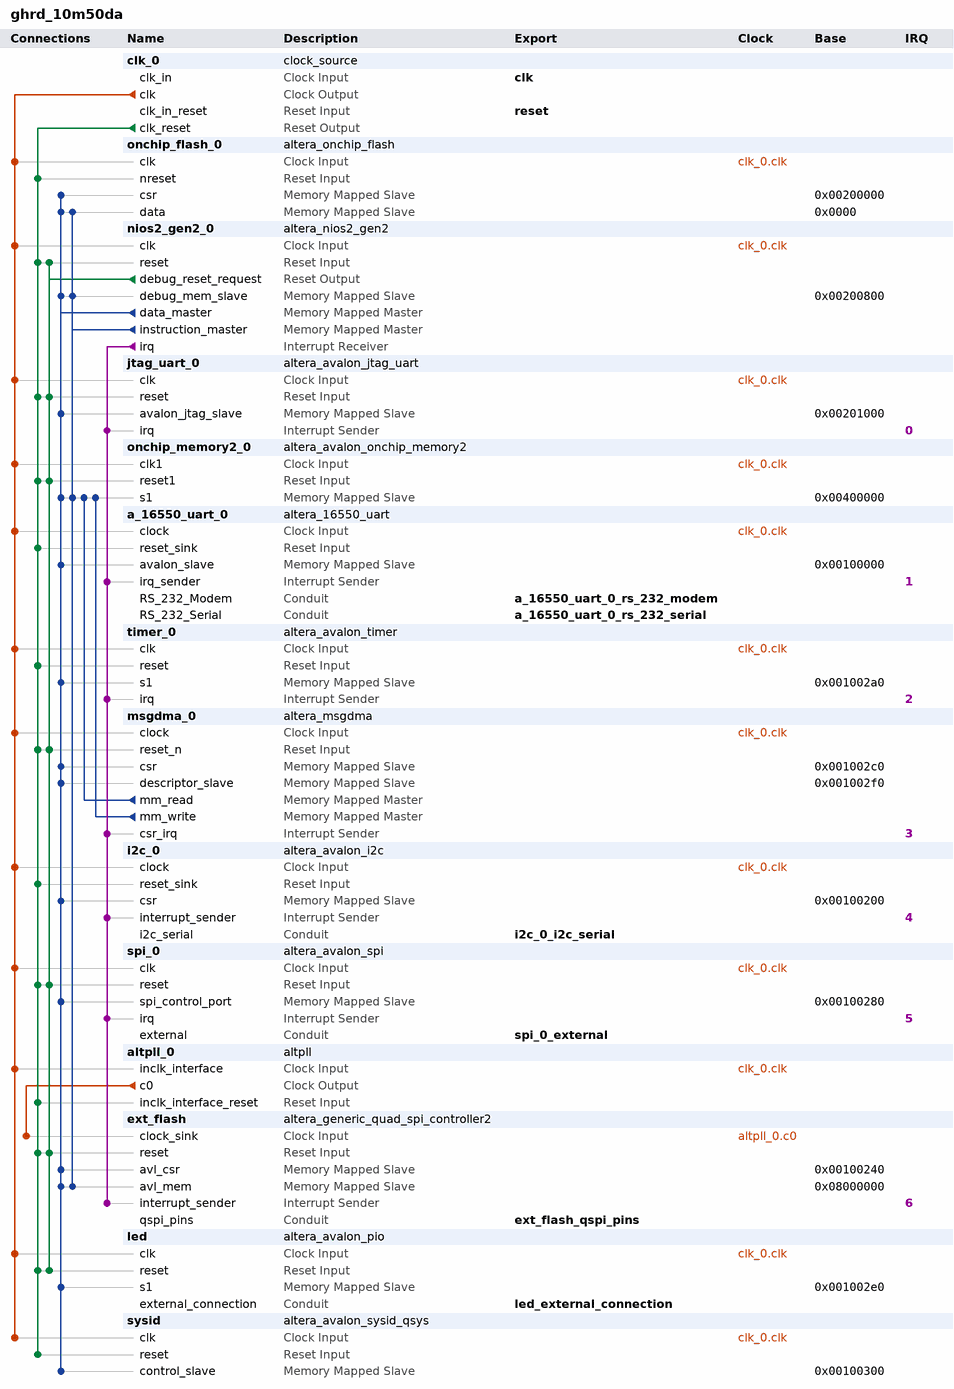
[diagram p0: system contents]
# Platform Designer (Qsys) system ghrd_10m50da, MAX 10 10M50DAF484C6GES
# Parameters at their usual value, and those the tool derives, are not listed.
package require -exact qsys 18.1
create_system ghrd_10m50da
set_project_property DEVICE_FAMILY {MAX 10}
set_project_property DEVICE 10M50DAF484C6GES

add_instance clk_0 clock_source 18.1
set_instance_parameter_value clk_0 clockFrequency 50000000

add_instance onchip_flash_0 altera_onchip_flash 18.1
set_instance_parameter_value onchip_flash_0 CONFIGURATION_MODE {Single Compressed Image}
set_instance_parameter_value onchip_flash_0 SECTOR_ACCESS_MODE {Read and write,Read and write,Read and write,Read and write,Hidden}
set_instance_parameter_value onchip_flash_0 initFlashContent false
set_instance_parameter_value onchip_flash_0 initializationFileName altera_onchip_flash.hex
set_instance_parameter_value onchip_flash_0 useNonDefaultInitFile false

add_instance nios2_gen2_0 altera_nios2_gen2 18.1
set_instance_parameter_value nios2_gen2_0 dcache_size 2048
set_instance_parameter_value nios2_gen2_0 debug_datatrigger 4
set_instance_parameter_value nios2_gen2_0 debug_hwbreakpoint 4
set_instance_parameter_value nios2_gen2_0 dividerType srt2
set_instance_parameter_value nios2_gen2_0 exceptionSlave onchip_memory2_0.s1
set_instance_parameter_value nios2_gen2_0 icache_size 4096
set_instance_parameter_value nios2_gen2_0 impl Fast
set_instance_parameter_value nios2_gen2_0 mul_64_impl 1
set_instance_parameter_value nios2_gen2_0 resetSlave onchip_flash_0.data

add_instance jtag_uart_0 altera_avalon_jtag_uart 18.1
set_instance_parameter_value jtag_uart_0 simInteractiveOptions NO_INTERACTIVE_WINDOWS
set_instance_parameter_value jtag_uart_0 useRegistersForReadBuffer true
set_instance_parameter_value jtag_uart_0 useRegistersForWriteBuffer true

add_instance onchip_memory2_0 altera_avalon_onchip_memory2 18.1
set_instance_parameter_value onchip_memory2_0 dataWidth 32
set_instance_parameter_value onchip_memory2_0 dualPort false
set_instance_parameter_value onchip_memory2_0 initMemContent false
set_instance_parameter_value onchip_memory2_0 initializationFileName onchip_mem.hex
set_instance_parameter_value onchip_memory2_0 memorySize 131072

add_instance a_16550_uart_0 altera_16550_uart 18.1
set_instance_parameter_value a_16550_uart_0 DMA_EXTRA 0
set_instance_parameter_value a_16550_uart_0 FAMILY {MAX 10}
set_instance_parameter_value a_16550_uart_0 FIFO_DEPTH 64
set_instance_parameter_value a_16550_uart_0 FIFO_HWFC 0
set_instance_parameter_value a_16550_uart_0 FIFO_MODE 1
set_instance_parameter_value a_16550_uart_0 FIFO_SWFC 0
set_instance_parameter_value a_16550_uart_0 FIFO_WATERMARK 0
set_instance_parameter_value a_16550_uart_0 MEM_BLOCK_TYPE AUTO

add_instance timer_0 altera_avalon_timer 18.1
set_instance_parameter_value timer_0 period 1
set_instance_parameter_value timer_0 periodUnits MSEC

add_instance msgdma_0 altera_msgdma 18.1
set_instance_parameter_value msgdma_0 BURST_ENABLE 1
set_instance_parameter_value msgdma_0 BURST_WRAPPING_SUPPORT 1
set_instance_parameter_value msgdma_0 DATA_FIFO_DEPTH 32
set_instance_parameter_value msgdma_0 DATA_WIDTH 32
set_instance_parameter_value msgdma_0 DESCRIPTOR_FIFO_DEPTH 128
set_instance_parameter_value msgdma_0 ENHANCED_FEATURES 0
set_instance_parameter_value msgdma_0 ERROR_ENABLE 0
set_instance_parameter_value msgdma_0 MAX_BURST_COUNT 2
set_instance_parameter_value msgdma_0 MAX_BYTE 1024
set_instance_parameter_value msgdma_0 MODE 0
set_instance_parameter_value msgdma_0 PACKET_ENABLE 0
set_instance_parameter_value msgdma_0 TRANSFER_TYPE {Aligned Accesses}

add_instance i2c_0 altera_avalon_i2c 18.1
set_instance_parameter_value i2c_0 FIFO_DEPTH 16

add_instance spi_0 altera_avalon_spi 18.1
set_instance_parameter_value spi_0 clockPhase 1
set_instance_parameter_value spi_0 clockPolarity 0
set_instance_parameter_value spi_0 dataWidth 8
set_instance_parameter_value spi_0 masterSPI true
set_instance_parameter_value spi_0 numberOfSlaves 1
set_instance_parameter_value spi_0 targetClockRate 128000

add_instance altpll_0 altpll 18.1
set_instance_parameter_value altpll_0 CLK0_DIVIDE_BY 2
set_instance_parameter_value altpll_0 CLK0_MULTIPLY_BY 1
set_instance_parameter_value altpll_0 INCLK0_INPUT_FREQUENCY 20000
set_instance_parameter_value altpll_0 PORT_ARESET PORT_UNUSED
set_instance_parameter_value altpll_0 PORT_LOCKED PORT_UNUSED
set_instance_parameter_value altpll_0 PORT_clk1 PORT_UNUSED
set_instance_parameter_value altpll_0 PORT_clk2 PORT_UNUSED
set_instance_parameter_value altpll_0 PORT_clk3 PORT_UNUSED

add_instance ext_flash altera_generic_quad_spi_controller2 18.1
set_instance_parameter_value ext_flash CHIP_SELS 1
set_instance_parameter_value ext_flash DDASI 1
set_instance_parameter_value ext_flash FLASH_TYPE Micron512
set_instance_parameter_value ext_flash GUI_USE_GPIO true
set_instance_parameter_value ext_flash IO_MODE QUAD
set_instance_parameter_value ext_flash clkFreq 25000000

add_instance led altera_avalon_pio 18.1
set_instance_parameter_value led direction Output
set_instance_parameter_value led width 4

add_instance sysid altera_avalon_sysid_qsys 18.1
set_instance_parameter_value sysid id 0

# connections
add_connection altpll_0.c0 ext_flash.clock_sink clock
add_connection clk_0.clk a_16550_uart_0.clock clock
add_connection clk_0.clk altpll_0.inclk_interface clock
add_connection clk_0.clk i2c_0.clock clock
add_connection clk_0.clk jtag_uart_0.clk clock
add_connection clk_0.clk led.clk clock
add_connection clk_0.clk msgdma_0.clock clock
add_connection clk_0.clk nios2_gen2_0.clk clock
add_connection clk_0.clk onchip_flash_0.clk clock
add_connection clk_0.clk onchip_memory2_0.clk1 clock
add_connection clk_0.clk spi_0.clk clock
add_connection clk_0.clk sysid.clk clock
add_connection clk_0.clk timer_0.clk clock
add_connection clk_0.clk_reset a_16550_uart_0.reset_sink reset
add_connection clk_0.clk_reset altpll_0.inclk_interface_reset reset
add_connection clk_0.clk_reset ext_flash.reset reset
add_connection clk_0.clk_reset i2c_0.reset_sink reset
add_connection clk_0.clk_reset jtag_uart_0.reset reset
add_connection clk_0.clk_reset led.reset reset
add_connection clk_0.clk_reset msgdma_0.reset_n reset
add_connection clk_0.clk_reset nios2_gen2_0.reset reset
add_connection clk_0.clk_reset onchip_flash_0.nreset reset
add_connection clk_0.clk_reset onchip_memory2_0.reset1 reset
add_connection clk_0.clk_reset spi_0.reset reset
add_connection clk_0.clk_reset sysid.reset reset
add_connection clk_0.clk_reset timer_0.reset reset
add_connection nios2_gen2_0.debug_reset_request ext_flash.reset reset
add_connection nios2_gen2_0.debug_reset_request jtag_uart_0.reset reset
add_connection nios2_gen2_0.debug_reset_request led.reset reset
add_connection nios2_gen2_0.debug_reset_request msgdma_0.reset_n reset
add_connection nios2_gen2_0.debug_reset_request nios2_gen2_0.reset reset
add_connection nios2_gen2_0.debug_reset_request onchip_memory2_0.reset1 reset
add_connection nios2_gen2_0.debug_reset_request spi_0.reset reset
add_connection msgdma_0.mm_read onchip_memory2_0.s1 avalon
set_connection_parameter_value msgdma_0.mm_read/onchip_memory2_0.s1 baseAddress 0x00400000
add_connection msgdma_0.mm_write onchip_memory2_0.s1 avalon
set_connection_parameter_value msgdma_0.mm_write/onchip_memory2_0.s1 baseAddress 0x00400000
add_connection nios2_gen2_0.data_master a_16550_uart_0.avalon_slave avalon
set_connection_parameter_value nios2_gen2_0.data_master/a_16550_uart_0.avalon_slave baseAddress 0x00100000
add_connection nios2_gen2_0.data_master ext_flash.avl_csr avalon
set_connection_parameter_value nios2_gen2_0.data_master/ext_flash.avl_csr baseAddress 0x00100240
add_connection nios2_gen2_0.data_master ext_flash.avl_mem avalon
set_connection_parameter_value nios2_gen2_0.data_master/ext_flash.avl_mem baseAddress 0x08000000
add_connection nios2_gen2_0.data_master i2c_0.csr avalon
set_connection_parameter_value nios2_gen2_0.data_master/i2c_0.csr baseAddress 0x00100200
add_connection nios2_gen2_0.data_master jtag_uart_0.avalon_jtag_slave avalon
set_connection_parameter_value nios2_gen2_0.data_master/jtag_uart_0.avalon_jtag_slave baseAddress 0x00201000
add_connection nios2_gen2_0.data_master led.s1 avalon
set_connection_parameter_value nios2_gen2_0.data_master/led.s1 baseAddress 0x001002e0
add_connection nios2_gen2_0.data_master msgdma_0.csr avalon
set_connection_parameter_value nios2_gen2_0.data_master/msgdma_0.csr baseAddress 0x001002c0
add_connection nios2_gen2_0.data_master msgdma_0.descriptor_slave avalon
set_connection_parameter_value nios2_gen2_0.data_master/msgdma_0.descriptor_slave baseAddress 0x001002f0
add_connection nios2_gen2_0.data_master nios2_gen2_0.debug_mem_slave avalon
set_connection_parameter_value nios2_gen2_0.data_master/nios2_gen2_0.debug_mem_slave baseAddress 0x00200800
add_connection nios2_gen2_0.data_master onchip_flash_0.csr avalon
set_connection_parameter_value nios2_gen2_0.data_master/onchip_flash_0.csr baseAddress 0x00200000
add_connection nios2_gen2_0.data_master onchip_flash_0.data avalon
set_connection_parameter_value nios2_gen2_0.data_master/onchip_flash_0.data baseAddress 0x0000
add_connection nios2_gen2_0.data_master onchip_memory2_0.s1 avalon
set_connection_parameter_value nios2_gen2_0.data_master/onchip_memory2_0.s1 baseAddress 0x00400000
add_connection nios2_gen2_0.data_master spi_0.spi_control_port avalon
set_connection_parameter_value nios2_gen2_0.data_master/spi_0.spi_control_port baseAddress 0x00100280
add_connection nios2_gen2_0.data_master sysid.control_slave avalon
set_connection_parameter_value nios2_gen2_0.data_master/sysid.control_slave baseAddress 0x00100300
add_connection nios2_gen2_0.data_master timer_0.s1 avalon
set_connection_parameter_value nios2_gen2_0.data_master/timer_0.s1 baseAddress 0x001002a0
add_connection nios2_gen2_0.instruction_master ext_flash.avl_mem avalon
set_connection_parameter_value nios2_gen2_0.instruction_master/ext_flash.avl_mem baseAddress 0x08000000
add_connection nios2_gen2_0.instruction_master nios2_gen2_0.debug_mem_slave avalon
set_connection_parameter_value nios2_gen2_0.instruction_master/nios2_gen2_0.debug_mem_slave baseAddress 0x00200800
add_connection nios2_gen2_0.instruction_master onchip_flash_0.data avalon
set_connection_parameter_value nios2_gen2_0.instruction_master/onchip_flash_0.data baseAddress 0x0000
add_connection nios2_gen2_0.instruction_master onchip_memory2_0.s1 avalon
set_connection_parameter_value nios2_gen2_0.instruction_master/onchip_memory2_0.s1 baseAddress 0x00400000
add_connection nios2_gen2_0.irq a_16550_uart_0.irq_sender interrupt
set_connection_parameter_value nios2_gen2_0.irq/a_16550_uart_0.irq_sender irqNumber 1
add_connection nios2_gen2_0.irq ext_flash.interrupt_sender interrupt
set_connection_parameter_value nios2_gen2_0.irq/ext_flash.interrupt_sender irqNumber 6
add_connection nios2_gen2_0.irq i2c_0.interrupt_sender interrupt
set_connection_parameter_value nios2_gen2_0.irq/i2c_0.interrupt_sender irqNumber 4
add_connection nios2_gen2_0.irq jtag_uart_0.irq interrupt
set_connection_parameter_value nios2_gen2_0.irq/jtag_uart_0.irq irqNumber 0
add_connection nios2_gen2_0.irq msgdma_0.csr_irq interrupt
set_connection_parameter_value nios2_gen2_0.irq/msgdma_0.csr_irq irqNumber 3
add_connection nios2_gen2_0.irq spi_0.irq interrupt
set_connection_parameter_value nios2_gen2_0.irq/spi_0.irq irqNumber 5
add_connection nios2_gen2_0.irq timer_0.irq interrupt
set_connection_parameter_value nios2_gen2_0.irq/timer_0.irq irqNumber 2

# exported interfaces
add_interface a_16550_uart_0_rs_232_modem conduit end
set_interface_property a_16550_uart_0_rs_232_modem EXPORT_OF a_16550_uart_0.RS_232_Modem
add_interface a_16550_uart_0_rs_232_serial conduit end
set_interface_property a_16550_uart_0_rs_232_serial EXPORT_OF a_16550_uart_0.RS_232_Serial
add_interface clk clock sink
set_interface_property clk EXPORT_OF clk_0.clk_in
add_interface ext_flash_qspi_pins conduit end
set_interface_property ext_flash_qspi_pins EXPORT_OF ext_flash.qspi_pins
add_interface i2c_0_i2c_serial conduit end
set_interface_property i2c_0_i2c_serial EXPORT_OF i2c_0.i2c_serial
add_interface led_external_connection conduit end
set_interface_property led_external_connection EXPORT_OF led.external_connection
add_interface reset reset sink
set_interface_property reset EXPORT_OF clk_0.clk_in_reset
add_interface spi_0_external conduit end
set_interface_property spi_0_external EXPORT_OF spi_0.external

set_interconnect_requirement {$system} qsys_mm.clockCrossingAdapter HANDSHAKE
set_interconnect_requirement {$system} qsys_mm.enableEccProtection FALSE
set_interconnect_requirement {$system} qsys_mm.insertDefaultSlave FALSE
set_interconnect_requirement {$system} qsys_mm.maxAdditionalLatency 1

save_system ghrd_10m50da.qsys
